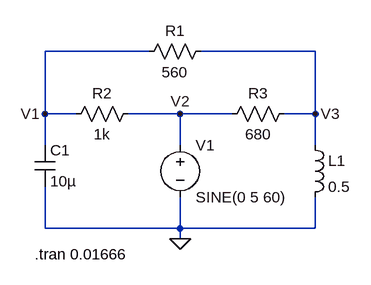
[diagram p0: schematic sim2-ac.asc]
sim2-ac.asc, the LTspice schematic file:
Version 4
SHEET 1 880 680
WIRE 64 16 -96 16
WIRE 320 16 144 16
WIRE -96 112 -96 16
WIRE -48 112 -96 112
WIRE 112 112 32 112
WIRE 192 112 112 112
WIRE 320 112 320 16
WIRE 320 112 272 112
WIRE -96 160 -96 112
WIRE 112 160 112 112
WIRE 320 160 320 112
WIRE -96 288 -96 224
WIRE 112 288 112 240
WIRE 112 288 -96 288
WIRE 320 288 320 240
WIRE 320 288 112 288
WIRE 112 304 112 288
FLAG 112 304 0
FLAG -96 112 V1
FLAG 112 112 V2
FLAG 320 112 V3
SYMBOL res 48 96 R90
WINDOW 0 0 56 VBottom 2
WINDOW 3 32 56 VTop 2
SYMATTR InstName R2
SYMATTR Value 1k
SYMBOL res 288 96 R90
WINDOW 0 0 56 VBottom 2
WINDOW 3 32 56 VTop 2
SYMATTR InstName R3
SYMATTR Value 680
SYMBOL res 160 0 R90
WINDOW 0 0 56 VBottom 2
WINDOW 3 32 56 VTop 2
SYMATTR InstName R1
SYMATTR Value 560
SYMBOL ind 304 144 R0
SYMATTR InstName L1
SYMATTR Value 0.5
SYMBOL voltage 112 144 R0
WINDOW 123 0 0 Left 2
WINDOW 39 0 0 Left 2
SYMATTR InstName V1
SYMATTR Value SINE(0 5 60)
SYMBOL cap -112 160 R0
SYMATTR InstName C1
SYMATTR Value 10µ
TEXT -112 328 Left 2 !.tran 0.01666

The netlist it stands for:
* sim2-ac.asc
R2 V2 V1 1k
R3 V3 V2 680
R1 V3 V1 560
L1 V3 0 0.5
V1 V2 0 SINE(0 5 60)
C1 V1 0 10µ
.tran 0.01666
.backanno
.end